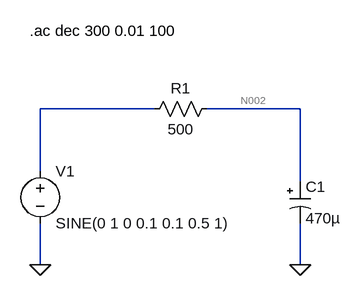
[diagram p0: schematic rc_serial_ltspice.asc]
rc_serial_ltspice.asc, the LTspice schematic file:
Version 4
SHEET 1 880 680
WIRE 320 160 144 160
WIRE 544 160 400 160
WIRE 144 256 144 160
WIRE 544 272 544 160
WIRE 144 400 144 336
WIRE 544 400 544 336
FLAG 144 400 0
FLAG 544 400 0
SYMBOL polcap 528 272 R0
WINDOW 3 24 56 Left 2
SYMATTR Value 470µ
SYMATTR InstName C1
SYMATTR Description Capacitor
SYMATTR Type cap
SYMATTR SpiceLine Rser=25m Lser=0 mfg="KEMET" pn="T520C477M2R5ATE025" type="Tantalum"
SYMBOL res 416 144 R90
WINDOW 0 0 56 VBottom 2
WINDOW 3 32 56 VTop 2
SYMATTR InstName R1
SYMATTR Value 500
SYMBOL voltage 144 240 R0
SYMATTR InstName V1
SYMATTR Value SINE(0 1 0 0.1 0.1 0.5 1)
SYMATTR Value2 AC 1
TEXT 128 40 Left 2 !.ac dec 300 0.01 100

The netlist it stands for:
* rc_serial_ltspice.asc
C1 N002 0 470µ Rser=25m Lser=0 mfg="KEMET" pn="T520C477M2R5ATE025" type="Tantalum"
R1 N002 N001 500
V1 N001 0 SINE(0 1 0 0.1 0.1 0.5 1) AC 1
.ac dec 300 0.01 100
.backanno
.end

* Results of the author's LTspice run, read from the files saved beside the schematic
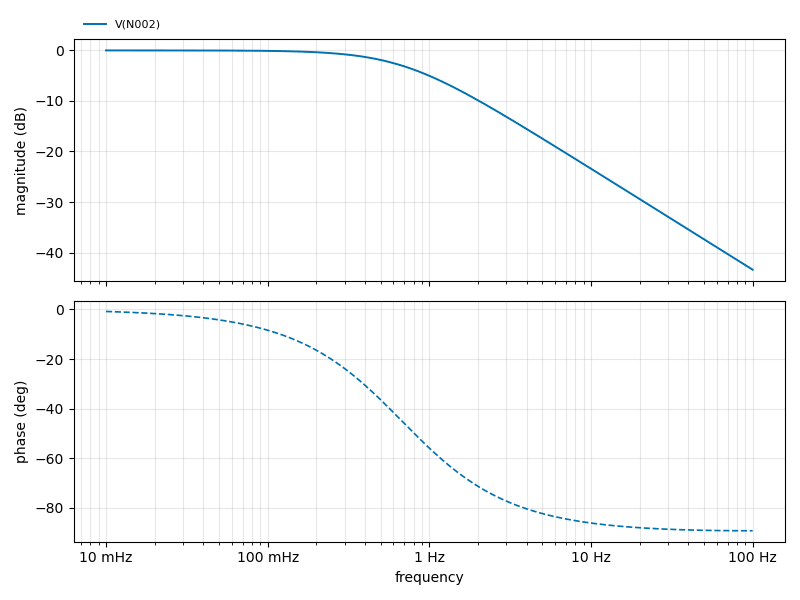
[diagram p1: AC Analysis of rc_serial_ltspice.asc, plotted from the saved traces]
* AC Analysis, 1 run:
*   V(N002): -0.00 dB at 10 mHz, -43.39 dB at 100 Hz, peak -0.00 dB at 10 mHz, 3 dB below the peak at 677.4 mHz